# EAGLE design Pyr0-Piezo_SingleDisk_Adapter_2pin (EAGLE 9.5.1)
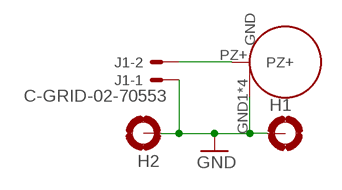
[diagram p0: schematic, sheet 1]

## Parts
H1  HOLES_MOUNT-PAD-ROUND3.2  [HOLES_3,2-PAD]
H2  HOLES_MOUNT-PAD-ROUND3.2  [HOLES_3,2-PAD]
J1  C-GRID-02-70553  [70553-02]
PZ1  PIEZO-DISK12MM  [PIEZO-DISK-12MM]

## Nets
GND: H1.B3,2(MOUNT) H2.B3,2(MOUNT) J1.1 PZ1.GND1(GND) PZ1.GND2(GND) PZ1.GND3(GND) PZ1.GND4(GND)
PZ+: J1.2 PZ1.PZ+

## Library data of the parts
H1 H2 = PiezoFFC:HOLES_MOUNT-PAD-ROUND: MOUNTING PAD, round
J1 = PiezoFFC:C-GRID-02: CONNECTOR wire to board 2.54 mm (0.100") pitch header; MF: MOLEX; OC_FARNELL: unknown; OC_NEWARK: unknown
PZ1 = PiezoFFC:PIEZO-DISK

## Board
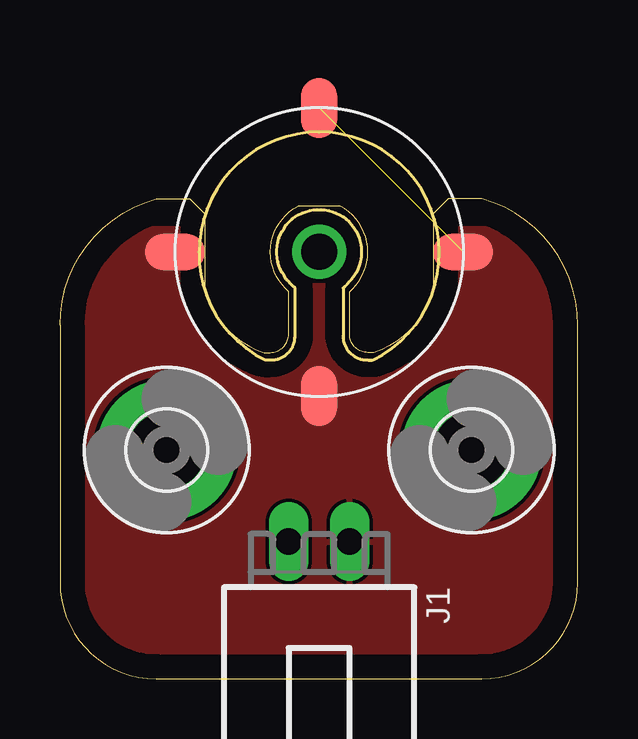
[diagram p1: board, top side]
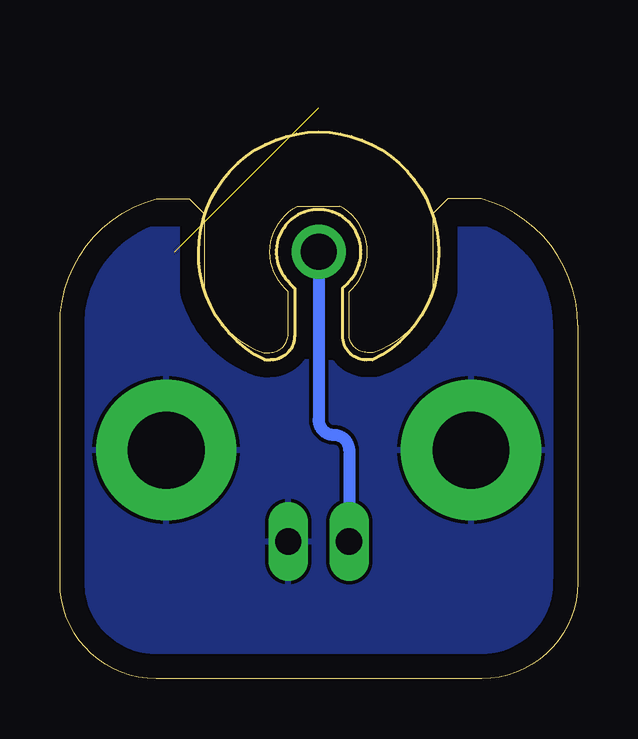
[diagram p2: board, bottom side, seen from below]

Size 21.57 x 19.99 mm. Coordinates in mm from the lower left corner, seen from the top.
Outline: 0,14.72 0,4 arc90 4,0 17.57,0 arc90 21.57,4 21.57,14.72 arc75 17.57,19.99 16.18,19.99 15.56,19.37 15.56,16.19 15.49,16 arc-53 13.08,13.59 12.83,13.59 arc-90 12.06,14.35 12.06,16.13 12.19,16.26 arc107 11.68,19.69 9.91,19.69 arc107 9.4,16.26 9.53,16.13 9.53,14.35 arc-90 8.76,13.59 8.51,13.59 arc-53 6.1,16 6.03,16.19 6.03,19.37 5.41,19.99 4.02,19.99 arc75 0,14.72
Copper layers (1*16): Top 0.035mm / dielectric 1.5mm / Bottom 0.035mm
Design rules "default *": minimum track width 6mil, minimum drill 0.35mm, track to track 6mil, track to pad 6mil, pad to pad 6mil, via to via 6mil, smd to smd 6mil, copper to edge 40mil, drill to drill 6mil, minimum pad ring 10mil, minimum via ring 8mil, stop-mask expansion 4mil, vias tented up to drill 0mil, thermal gap 6mil

### Footprints (pad centres in the part's own frame; a part is rotated, then mirrored left to right if it is on the bottom)
HOLES_3,2-PAD = drill 3.2 pad 5.842: B3,2 0,0
70553-02 = drill 1.092 long: 1 -1.27,-7.62; 2 1.27,-7.62
PIEZO-DISK-12MM = smd 1.5 x 2.5: GND1 0,6; GND3 0,-6 | smd 2.5 x 1.5: GND2 6,0; GND4 -6,0 | drill 1.5: PZ+ 0,0

### Placement (x,y rotation side)
H1  17.14,9.53 0 top
H2  4.45,9.53 0 top
J1  10.79,-1.9 180 top
PZ1  10.79,17.78 180 top

### Tracks (layer width: path | path; a pad name or v marks a point on that pad's centre or on a via)
GND  (1 unrouted)
  pour Top: 0,18.72 0,0 21.57,0 21.57,18.72 13.03,18.72 12.06,19.69 9.53,19.69 8.56,18.72
  pour Bottom: 0,18.72 0,0 21.57,0 21.57,18.72 13.03,18.72 12.06,19.69 9.53,19.69 8.56,18.72
PZ+
  Bottom 0.508: PZ1.PZ+ 10.79,10.8 arc-90 10.16,10.16 arc90 9.53,9.53 J1.2